# EAGLE design ArduinoLabButtons (EAGLE 5.11)
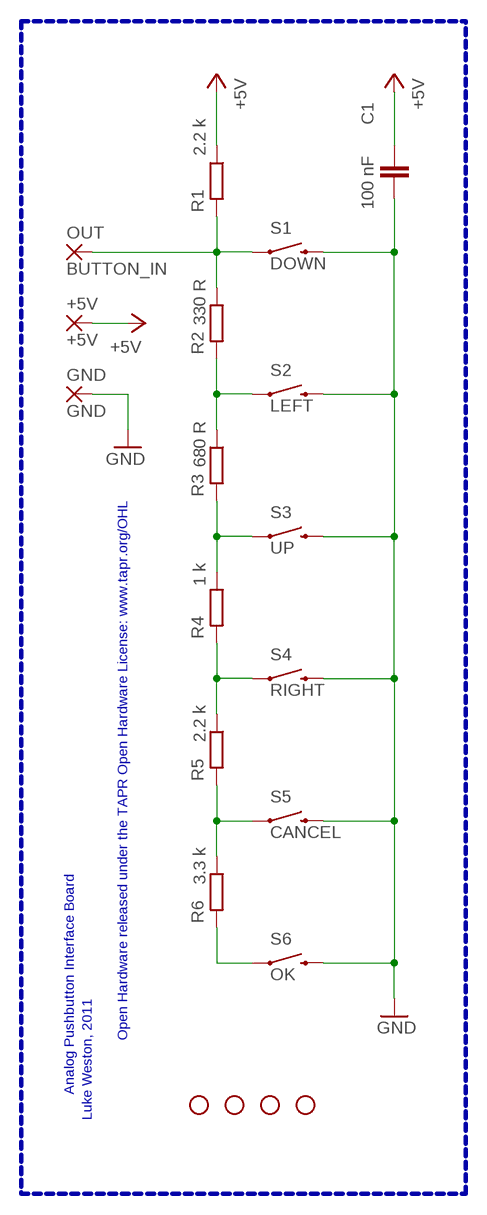
[diagram p0: schematic, sheet 1]

## Parts
+5V  +5V  WIREPAD3,81/1,3  [3,81/1,3]
C1  100 nF  C-EU025-024X044  [C025-024X044]
GND  GND  WIREPAD3,81/1,3  [3,81/1,3]
JP1  STAND-OFF  [STAND-OFF]
JP2  STAND-OFF  [STAND-OFF]
JP3  STAND-OFF  [STAND-OFF]
JP4  STAND-OFF  [STAND-OFF]
OUT  BUTTON_IN  WIREPAD3,81/1,3  [3,81/1,3]
R1  2.2 k  R-EU_0207/10  [0207/10]
R2  330 R  R-EU_0207/10  [0207/10]
R3  680 R  R-EU_0207/10  [0207/10]
R4  1 k  R-EU_0207/10  [0207/10]
R5  2.2 k  R-EU_0207/10  [0207/10]
R6  3.3 k  R-EU_0207/10  [0207/10]
S1  DOWN  SWITCH-MOMENTARY-2PTH  [TACTILE-PTH]
S2  LEFT  SWITCH-MOMENTARY-2PTH  [TACTILE-PTH]
S3  UP  SWITCH-MOMENTARY-2PTH  [TACTILE-PTH]
S4  RIGHT  SWITCH-MOMENTARY-2PTH  [TACTILE-PTH]
S5  CANCEL  SWITCH-MOMENTARY-2PTH  [TACTILE-PTH]
S6  OK  SWITCH-MOMENTARY-2PTH  [TACTILE-PTH]

## Nets
+5V: +5V.1(P) C1.1 R1.1
ADC_BUTTONS: OUT.1(P) R1.2 R2.1 S1.1
GND: C1.2 GND.1(P) S1.3 S2.3 S3.3 S4.3 S5.3 S6.3
N$3: R2.2 R3.1 S2.1
N$4: R3.2 R4.1 S3.1
N$25: R4.2 R5.1 S4.1
N$26: R5.2 R6.1 S5.1
N$27: R6.2 S6.1

## Buses
B$3

## Notes on the sheet
- Open Hardware released under the TAPR Open Hardware License: www.tapr.org/OHL
- Analog Pushbutton Interface Board
- Luke Weston, 2011

## Library data of the parts
+5V GND OUT = wirepad:WIREPAD: Wire PAD connect wire on PCB
C1 = rcl:C-EU: CAPACITOR, European symbol
JP1-JP4 = SparkFun:STAND-OFF: Stand Off This is the mechanical footprint for a #4 phillips button head screw. Use the keepout ring to avoid running the screw head into surrounding components. SKU : PRT-00447
R1-R6 = rcl:R-EU_: RESISTOR, European symbol
S1-S6 = SparkFun:SWITCH-MOMENTARY-2

## Board
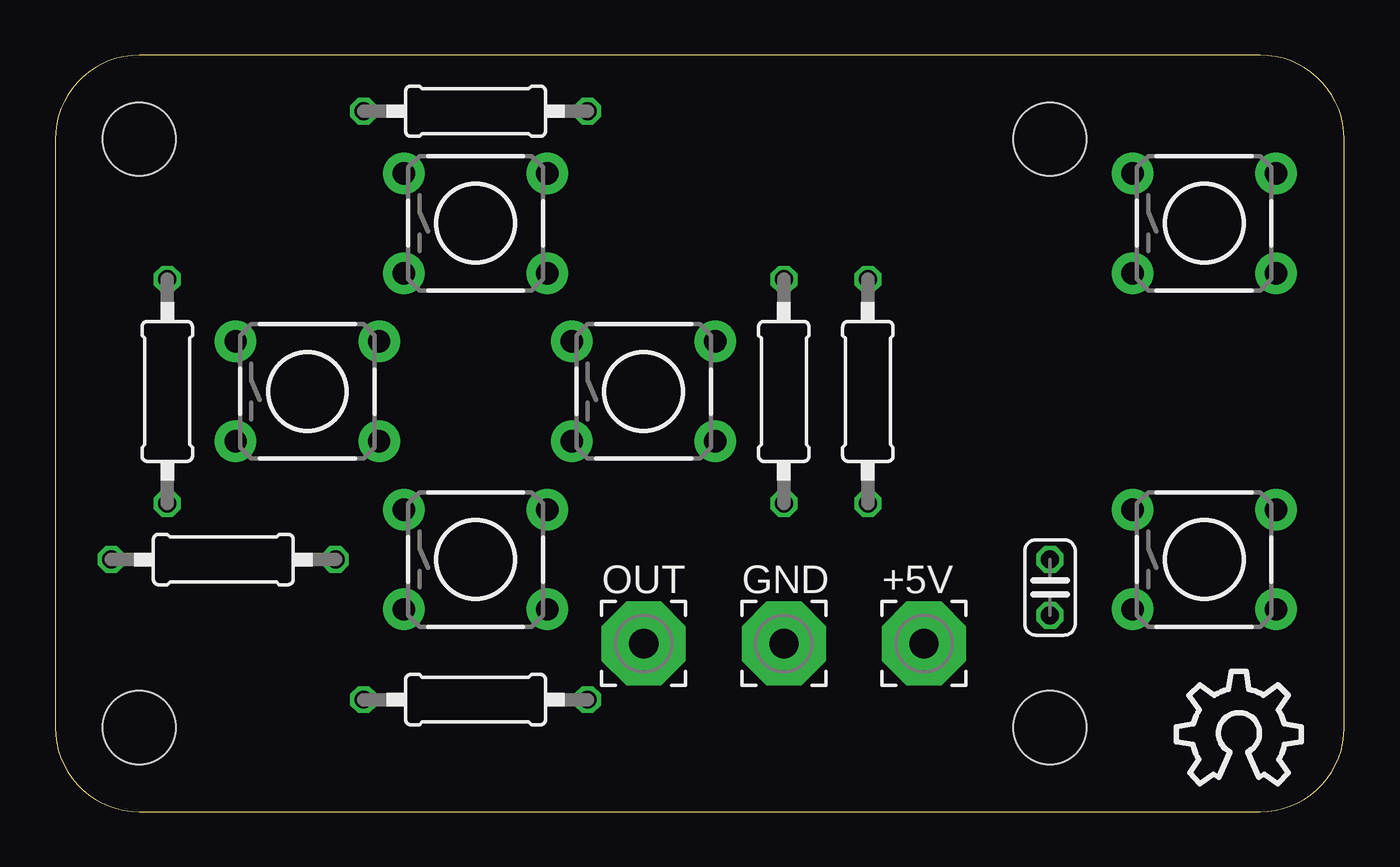
[diagram p1: board, top side]
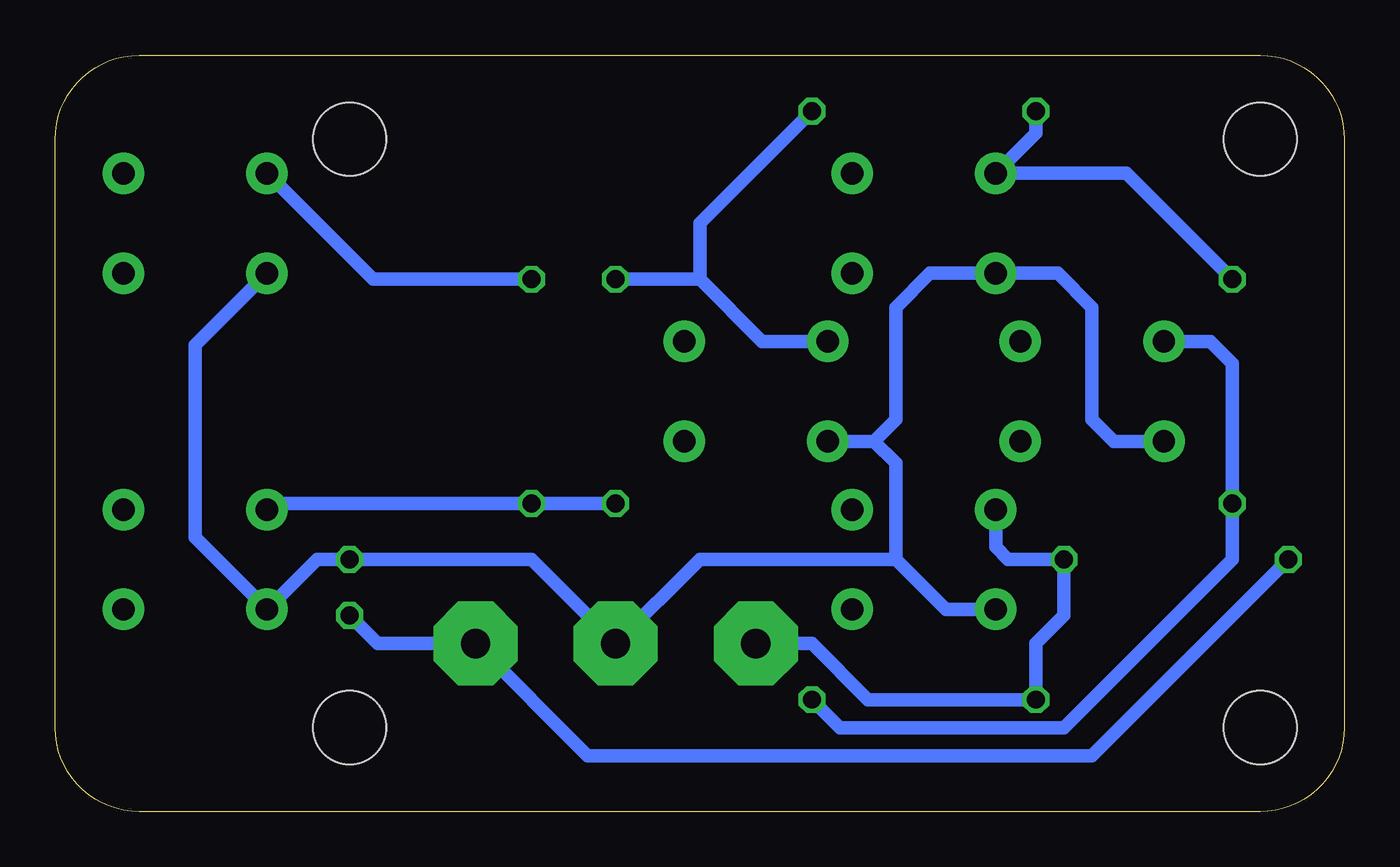
[diagram p2: board, bottom side, seen from below]

Size 58.42 x 34.29 mm. Coordinates in mm from the lower left corner, seen from the top.
Outline: 0,3.81 arc90 3.81,0 54.61,0 arc90 58.42,3.81 58.42,30.48 arc90 54.61,34.29 3.81,34.29 arc90 0,30.48 0,3.81
Copper layers (1*16): Top 0.035mm / dielectric 1.5mm / Bottom 0.035mm
Design rules "PCBCart-Standard": minimum track width 8mil, minimum drill 0.4mm, track to track 8mil, track to pad 8mil, pad to pad 8mil, via to via 8mil, smd to smd 8mil, copper to edge 20mil, drill to drill 8mil, minimum pad ring 8mil, minimum via ring 10mil, stop-mask expansion 3mil, vias tented up to drill 0mil, thermal gap 8mil

### Footprints (pad centres in the part's own frame; a part is rotated, then mirrored left to right if it is on the bottom)
3,81/1,3 = drill 1.321 pad 3.81 octagon: 1 0,0
C025-024X044 = drill 0.813 octagon: 1 -1.27,0; 2 1.27,0
STAND-OFF = hole 3.302: 0,0
0207/10 = drill 0.813 octagon: 1 -5.08,0; 2 5.08,0
TACTILE-PTH = drill 1.016 pad 1.88 round: 1 -3.251,2.261; 2 3.251,2.261; 3 -3.251,-2.261; 4 3.251,-2.261

### Placement (x,y rotation side)
+5V  39.37,7.62 0 top
C1  45.08,10.16 90 top
GND  33.02,7.62 0 top
JP1  45.08,3.81 90 top
JP2  45.08,30.48 0 top
JP3  3.81,3.81 0 top
JP4  3.81,30.48 0 top
OUT  26.67,7.62 0 top
R1  7.62,11.43 0 top
R2  19.05,5.08 0 top
R3  5.08,19.05 90 top
R4  19.05,31.75 0 top
R5  33.02,19.05 270 top
R6  36.83,19.05 90 top
S1  19.05,11.43 0 top
S2  11.43,19.05 0 top
S3  19.05,26.67 0 top
S4  26.67,19.05 0 top
S5  52.07,11.43 0 top
S6  52.07,26.67 0 top
U$1  [OSHW_10X200_NOTEXT]  50.8,1.27 0 top

### Tracks (layer width: path | path; a pad name or v marks a point on that pad's centre or on a via)
+5V
  Bottom 0.61: R1.1 11.43,2.54 34.29,2.54 +5V.1 43.81,7.62 C1.1
ADC_BUTTONS
  Bottom 0.61: S1.1 15.8,11.99 15.24,11.43 R1.2 12.7,8.89 13.97,7.62 R2.1 21.59,5.08 24.13,7.62 OUT.1
GND
  Bottom 0.61: S1.3 18.06,9.17 20.32,11.43 | S2.3 10.44,16.79 11.43,17.78 11.43,22.86 12.98,24.41 S3.3 18.77,24.41 20.32,22.86 20.32,17.78 21.31,16.79 | 21.31,16.79 S4.3 | 20.32,11.43 20.32,15.8 21.31,16.79 | C1.2 39.37,11.43 | C1.2 46.56,11.43 S5.3 52.07,12.42 52.07,21.16 S6.3 | 20.32,11.43 29.21,11.43 GND.1 36.83,11.43 C1.2
N$3
  Bottom 0.61: S2.1 6.07,21.31 5.08,20.32 R3.1 5.08,11.43 12.7,3.81 22.86,3.81 R2.2
N$4
  Bottom 0.61: R3.2 9.88,28.93 S3.1 13.97,30.76 R4.1
N$25
  Bottom 0.61: S4.1 26.39,21.31 29.21,24.13 | 29.21,24.13 R5.1 | 29.21,24.13 29.21,26.67 R4.2
N$26
  Bottom 0.61: R5.2 R6.1 48.54,13.97 S5.1
N$27
  Bottom 0.61: R6.2 44.02,24.13 S6.1

### Text on the board
Document: OK | UP | LEFT | RIGHT | DOWN | CANCEL | Analog Pushbutton Interface Board | Luke Weston, 2011 | Released under the TAPR Open Hardware License